# EAGLE design EndStop (EAGLE 7.2.0)
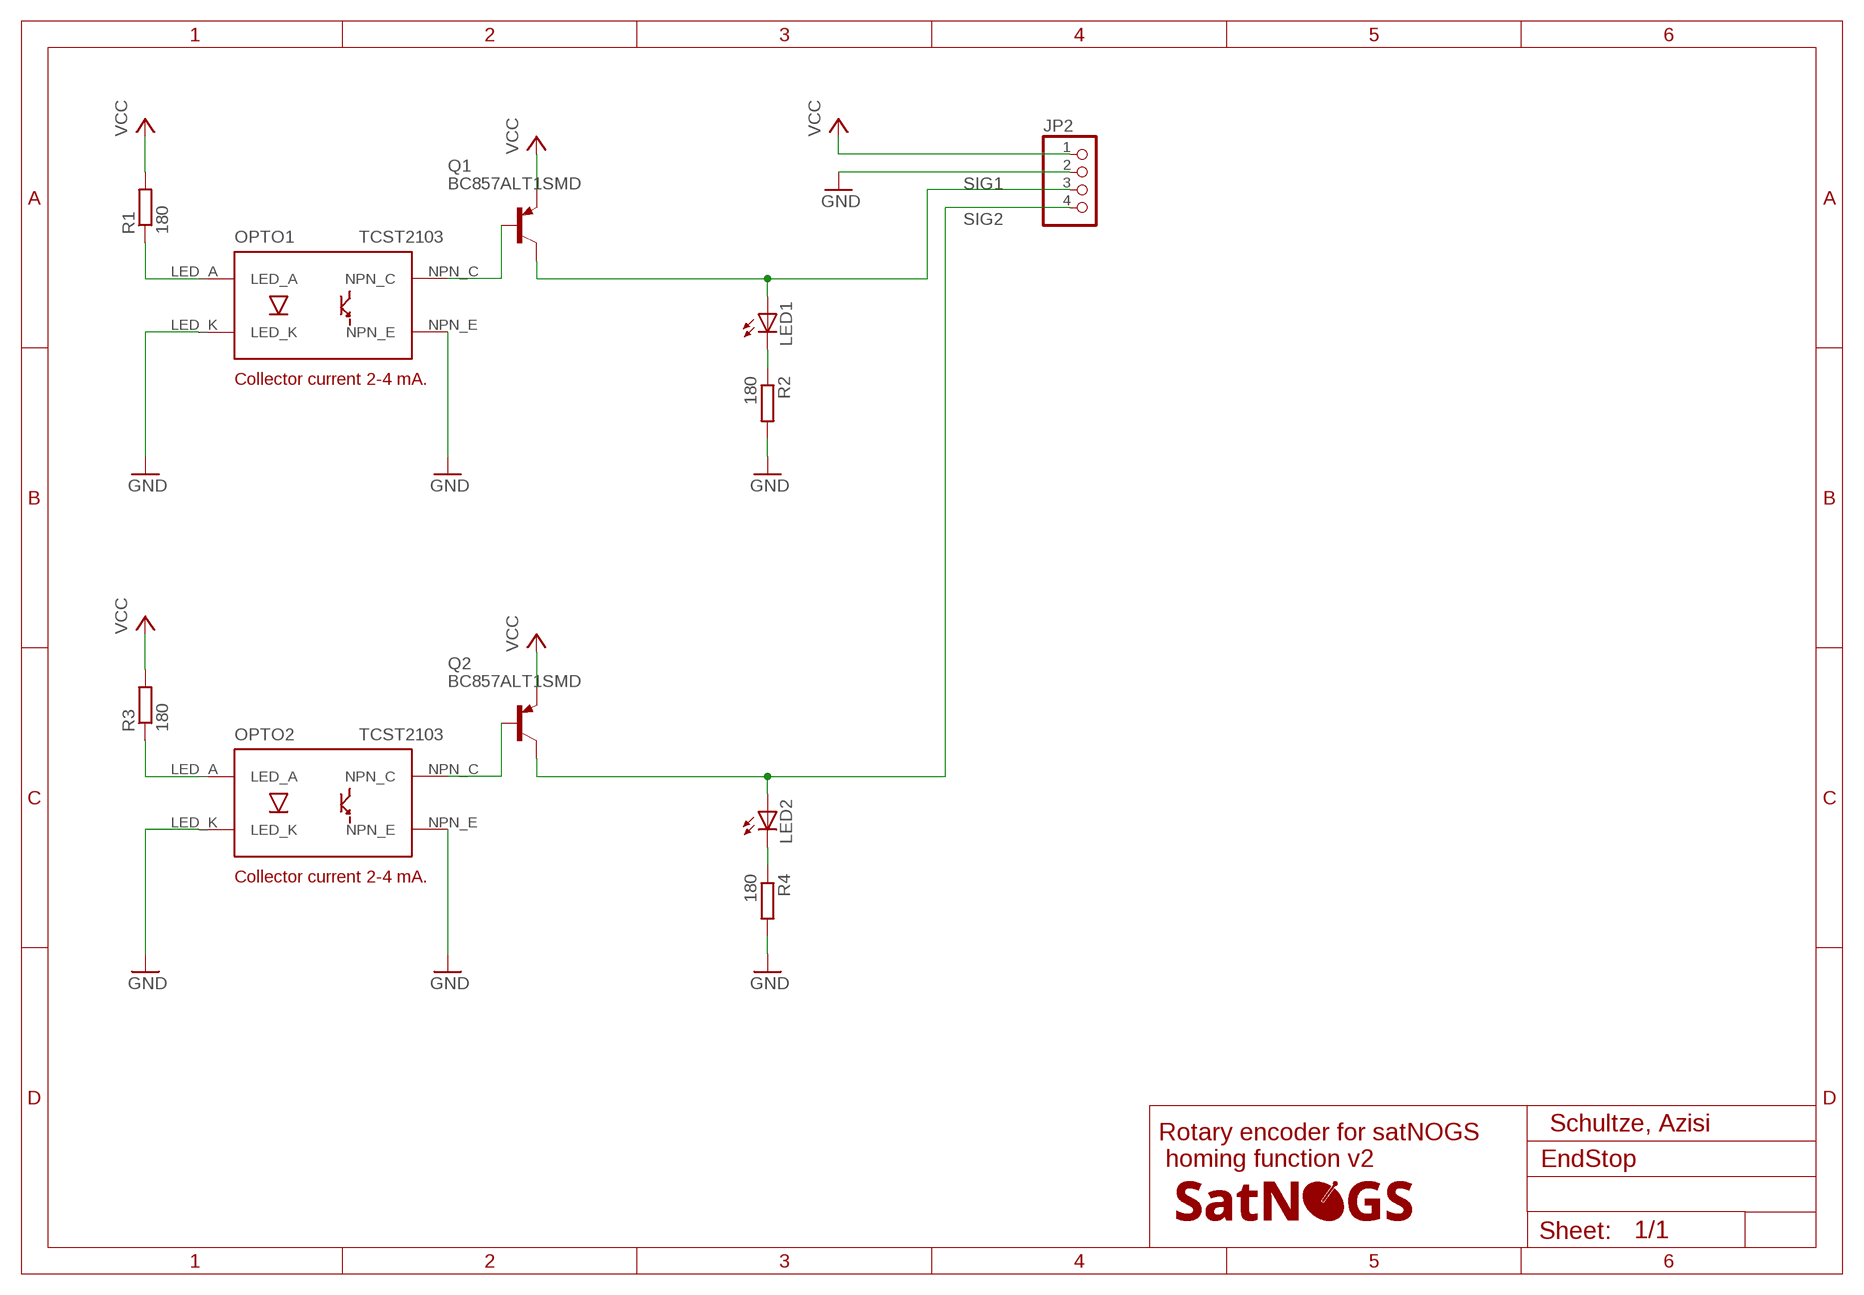
[diagram p0: schematic, sheet 1]

## Parts
JP2  PINHD-1X4  [1X04]
LED1  LED3MM  [LED3MM]
LED2  LED3MM  [LED3MM]
LOGO1  SATNOGS_LOGOSILK_XS  [LOGO_SILK_XS]
OPTO1  TCST2103  [TCST2013]
OPTO2  TCST2103  [TCST2013]
Q1  BC857ALT1SMD  [SOT23-BEC]
Q2  BC857ALT1SMD  [SOT23-BEC]
R1  180  R-EU_R0805  [R0805]
R2  180  R-EU_R0805  [R0805]
R3  180  R-EU_R0805  [R0805]
R4  180  R-EU_R0805  [R0805]

## Nets
GND: JP2.2 OPTO1.LED_K OPTO1.NPN_E OPTO2.LED_K OPTO2.NPN_E R2.2 R4.2
N$1: OPTO2.LED_A R3.1
N$2: OPTO1.LED_A R1.1
N$3: LED1.K(C) R2.1
N$4: OPTO1.NPN_C Q1.B
N$5: LED2.K(C) R4.1
N$6: OPTO2.NPN_C Q2.B
SIG1: JP2.3 LED1.A Q1.C
SIG2: JP2.4 LED2.A Q2.C
VCC: JP2.1 Q1.E Q2.E R1.2 R3.2

## Notes on the sheet
- Collector current 2-4 mA.
- Collector current 2-4 mA.
- Schultze, Azisi
- Rotary encoder for satNOGS
   homing function v2

## Library data of the parts
JP2 = pinhead:PINHD-1X4: PIN HEADER
LED1 LED2 = led:LED: LED OSRAM: - CHIPLED LG R971, LG N971, LY N971, LG Q971, LY Q971, LO R971, LY R971 LH N974, LH R974 LS Q976, LO Q976, LY Q976 LO Q996 - Hyper CHIPLED LW Q18S LB Q993, LB Q99A, LB R99A - SideLED LS A670, LO A670, LY A670, LG A670, LP A670 LB A673, LV A673, LT A673, LW A673 LH A674 LY A675 LS A676, LA A676, LO A676, LY A676, LW A676 LS A679, LY A679, LG A679 - Hyper Micro SIDELED® LS Y876, LA Y876, LO Y876, LY Y876 LT Y87S - SmartLED LW L88C, LW L88S LB L89C, LB L89S, LG L890 LS L89K, LO L89K, LY L89K LS L896, LA L896, LO L896, LY L896 - TOPLED LS T670, LO T670, LY T670, LG T670, LP T670 LSG T670, LSP T670, LSY T670, LOP T670, LYG T670 LG T671, LOG T671, LSG T671 LB T673, LV T673, LT T673, LW T673 LH T674 LS T676, LA T676, LO T676, LY T676, LB T676, LH T676, LSB T676, LW T676 LB T67C, LV T67C, LT T67C, LS T67K, LO T67K, LY T67K, LW E67C LS E67B, LA E67B, LO E67B, LY E67B, LB E67C, LV E67C, LT E67C LW T67C LS T679, LY T679, LG T679 LS T770, LO T770, LY T770, LG T770, LP T770 LB T773, LV T773, LT T773, LW T773 LH T774 LS E675, LA E675, LY E675, LS T675 LS T776, LA T776, LO T776, LY T776, LB T776 LHGB T686 LT T68C, LB T68C - Hyper Mini TOPLED® LB M676 - Mini TOPLED Santana® LG M470 LS M47K, LO M47K, LY M47K Source: http://www.osram.convergy.de LUXEON: - LUMILED® LXK2-PW12-R00, LXK2-PW12-S00, LXK2-PW14-U00, LXK2-PW14-V00 LXK2-PM12-R00, LXK2-PM12-S00, LXK2-PM14-U00 LXK2-PE12-Q00, LXK2-PE12-R00, LXK2-PE12-S00, LXK2-PE14-T00, LXK2-PE14-U00 LXK2-PB12-K00, LXK2-PB12-L00, LXK2-PB12-M00, LXK2-PB14-N00, LXK2-PB14-P00, LXK2-PB14-Q00 LXK2-PR12-L00, LXK2-PR12-M00, LXK2-PR14-Q00, LXK2-PR14-R00 LXK2-PD12-Q00, LXK2-PD12-R00, LXK2-PD12-S00 LXK2-PH12-R00, LXK2-PH12-S00 LXK2-PL12-P00, LXK2-PL12-Q00, LXK2-PL12-R00 Source: www.luxeon.com KINGBRIGHT: KA-3528ASYC Source: www.kingbright.com
LOGO1 = satnogs:SATNOGS_LOGO
OPTO1 OPTO2 = satnogs:TCST2103
Q1 Q2 = transistor-pnp:BC857*: PNP Transistror
R1-R4 = rcl:R-EU_: RESISTOR, European symbol

## Net classes
0 default: width 0.508 mm, drill 0.813 mm, clearance 0.254 mm

## Board
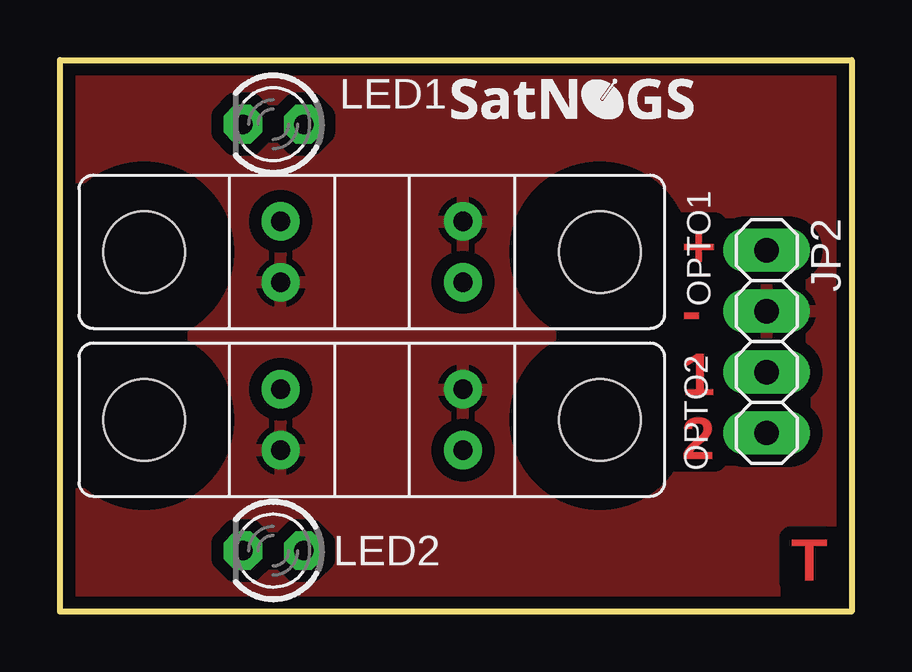
[diagram p1: board, top side]
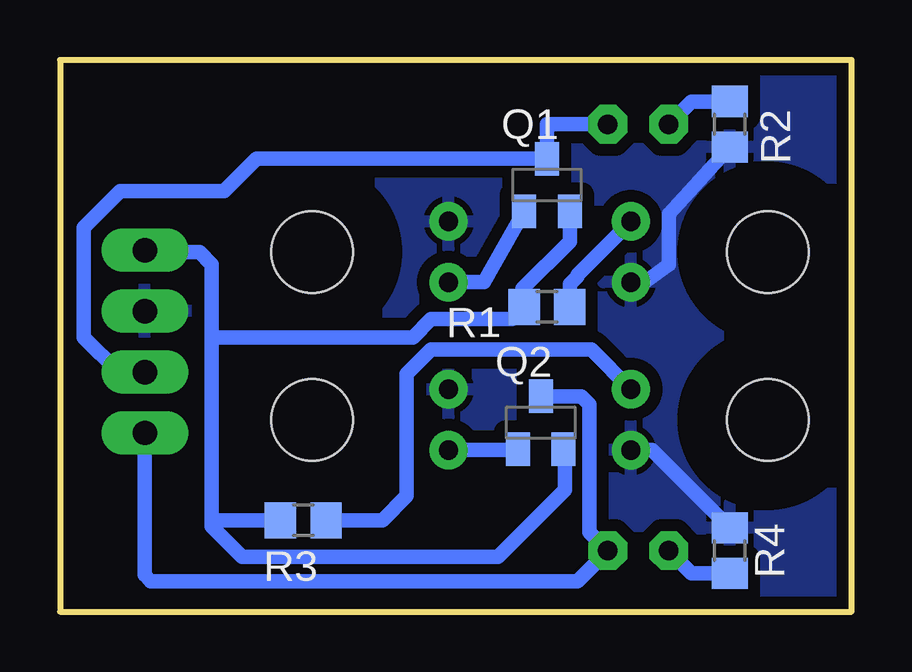
[diagram p2: board, bottom side, seen from below]

Size 33 x 23 mm. Coordinates in mm from the lower left corner, seen from the top.
Outline: 0,0 0,23 33,23 33,0 0,0
Copper layers (1*16): Top 0.035mm / dielectric 1.5mm / Bottom 0.035mm
Design rules "SeeedStudio_2layer_DRU_no_angle_20140221 *": minimum track width 16mil, minimum drill 0.8mm, track to track 6mil, track to pad 6mil, pad to pad 6mil, via to via 6mil, smd to smd 0mil, copper to edge 10mil, drill to drill 10mil, minimum pad ring 0.4mm, minimum via ring 0.4mm, stop-mask expansion 2mil, vias tented up to drill 100mil, thermal gap 10mil

### Footprints (pad centres in the part's own frame; a part is rotated, then mirrored left to right if it is on the bottom)
1X04 = drill 1.016 long: 1 -3.81,0; 2 -1.27,0; 3 1.27,0; 4 3.81,0
LED3MM = drill 0.813 octagon: A -1.27,0; K 1.27,0
TCST2013 = drill 0.8: LED_A -3.8,1.27; LED_K -3.8,-1.27; NPN_C 3.8,-1.27; NPN_E 3.8,1.27 | hole 3.4: -9.5,0; 9.5,0
SOT23-BEC = smd 1 x 1.4: B -0.95,-1.1; C 0,1.1; E 0.95,-1.1
R0805 = smd 1.3 x 1.5: 1 -0.95,0; 2 0.95,0

### Placement (x,y rotation side)
JP2  29.46,11.26 270 top
LED1  8.89,20.32 180 top
LED2  8.89,2.54 180 top
LOGO1  16.32,20.52 0 top
OPTO1  13,15 0 top
OPTO2  13,8 0 top
Q1  12.7,17.78 0 bottom
Q2  12.95,7.87 0 bottom
R1  12.7,12.7 180 bottom
R2  5.08,20.32 270 bottom
R3  22.86,3.81 180 bottom
R4  5.08,2.54 90 bottom

### Tracks (layer width: path | path; a pad name or v marks a point on that pad's centre or on a via)
GND
  Bottom 0.61: R2.2 7.62,16.58 7.62,14.48 8.62,13.73 OPTO1.LED_K | R4.2 8.32,6.73 OPTO2.LED_K
  pour Bottom (isolate 0.508): 33.6,0 0,0 0,22.62 33.6,22.62
  pour Top (isolate 0.508, rank 2): 0,0 32.89,0 32.89,22.73 0,22.73
N$1
  Bottom 0.61: R3.1 19.56,3.81 18.54,4.83 18.54,9.91 17.53,10.92 10.85,10.92 OPTO2.LED_A
N$2
  Bottom 0.61: OPTO1.LED_A 11.43,14.04 11.43,13.97 11.75,13.65 R1.1
N$3
  Bottom 0.61: LED1.K 6.67,21.27 R2.1
N$4
  Bottom 0.61: Q1.B 15.33,13.73 OPTO1.NPN_C
N$5
  Bottom 0.61: LED2.K 6.67,1.59 R4.1
N$6
  Bottom 0.61: Q2.B 13.95,6.73 OPTO2.NPN_C
SIG1
  Bottom 0.61: LED1.A 12.7,20.32 Q1.C 24.81,18.88 26.16,17.53 30.48,17.53 32,16 32,11.43 30.56,9.99 JP2.3
SIG2
  Bottom 0.61: Q2.C 11.26,8.97 10.92,8.64 10.92,3.3 LED2.A 11.43,1.27 29.21,1.27 29.46,1.52 JP2.4
VCC
  Bottom 0.61: Q2.E 11.94,6.71 11.94,5.08 14.73,2.29 25.4,2.29 26.67,3.56 26.67,3.81 | Q1.E 11.75,15.43 13.72,13.46 13.72,12.77 R1.2 14.16,12.19 17.53,12.19 18.29,11.43 26.67,11.43 | 26.67,3.81 26.67,11.43 | 26.67,11.43 26.67,14.48 27.18,14.99 29.38,14.99 JP2.1 | R3.2 26.67,3.81

### Text on the board
Top: + / - / 1 / 2 | T